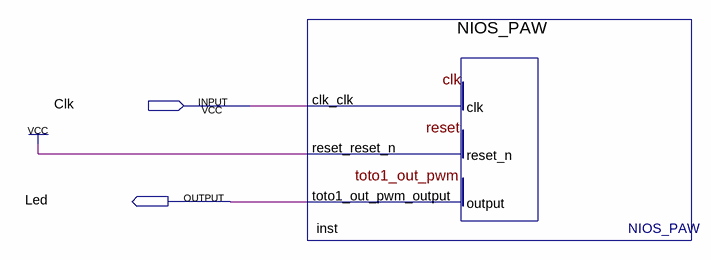
[diagram p0: schematic sheet]
// Quartus schematic NIOS_PWM.bdf as structural Verilog: 1 symbols, 2 pins
module NIOS_PWM (
  input  Clk,
  output Led
);

  NIOS_PAW inst (.clk_clk(Clk), .reset_reset_n(1'b1), .toto1_out_pwm_output(Led));
endmodule
